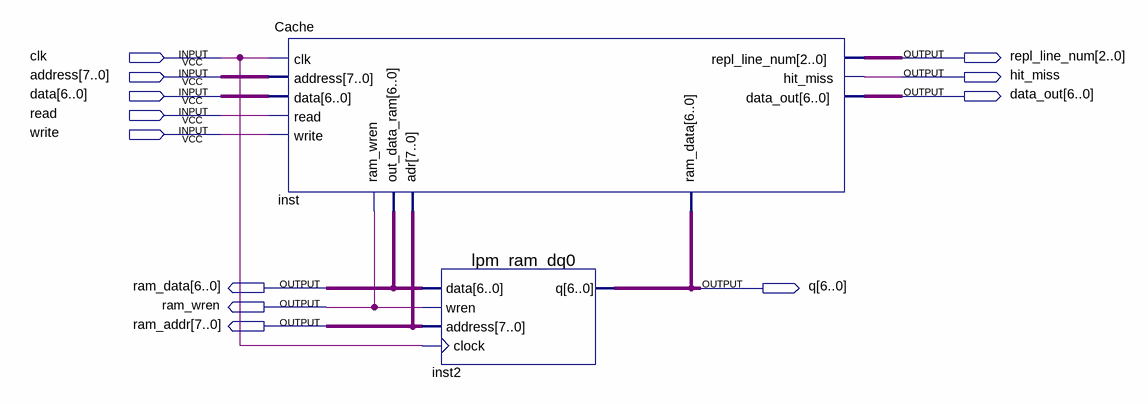
[diagram p0: schematic sheet]
// Quartus schematic lab6_7.bdf as structural Verilog: 2 symbols, 12 pins
module lab6_7 (
  input  clk,
  input  [7:0] address,
  input  [6:0] data,
  input  read,
  input  write,
  output [2:0] repl_line_num,
  output hit_miss,
  output [6:0] data_out,
  output [6:0] ram_data,
  output [6:0] q,
  output ram_wren,
  output [7:0] ram_addr
);

  Cache inst (
    .clk(clk), .read(read), .data(data), .ram_data(q), .address(address), .write(write), .ram_wren(ram_wren),
    .out_data_ram(ram_data), .adr(ram_addr), .repl_line_num(repl_line_num), .hit_miss(hit_miss),
    .data_out(data_out));
  lpm_ram_dq0 inst2 (.data(ram_data), .wren(ram_wren), .address(ram_addr), .clock(clk), .q(q));
endmodule
